# EAGLE design dual-tda1543-dac (EAGLE 6.5.0)
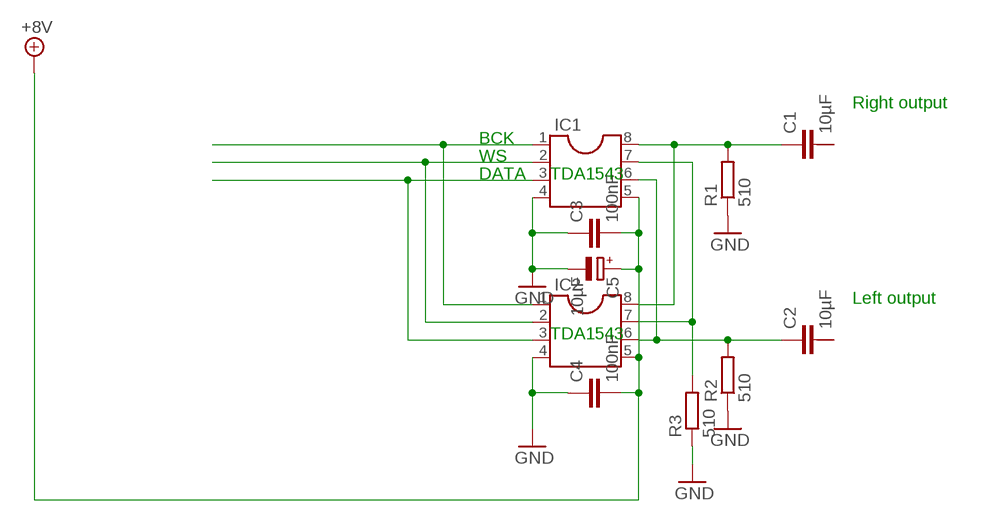
[diagram p0: schematic, sheet 1]

## Parts
C1  10µF  C-10-15/6  [C10-15B6]
C2  10µF  C-10-15/6  [C10-15B6]
C3  100nF  C-EU025-024X044  [C025-024X044]
C4  100nF  C-EU025-024X044  [C025-024X044]
C5  10µF  CPOL-EUE3.5-8  [E3,5-8]
IC1  TDA1543S  [SOCKED-08]
IC2  TDA1543S  [SOCKED-08]
R1  510  R-EU_0207/7  [0207/7]
R2  510  R-EU_0207/7  [0207/7]
R3  510  R-EU_0207/7  [0207/7]

## Nets
+5V: C3.2 C4.2 C5.+ IC1.5(AOR) IC2.5(AOR) ; supply symbol labelled +8V
GND: C3.1 C4.1 C5.- IC1.4(GND) IC2.4(GND) R1.1 R2.1 R3.1
N$1: IC1.1(BCK) IC2.1(BCK)
N$2: IC1.2(WS) IC2.2(WS)
N$3: IC1.3(DATA) IC2.3(DATA)
N$4: C2.1 IC1.6(VREF) IC2.6(VREF) R2.2
N$5: C1.1 IC1.8(VDD) IC2.8(VDD) R1.2
N$6: IC1.7(AOL) IC2.7(AOL) R3.2
Unconnected: C1.2 C1.3 C2.2 C2.3

## Notes on the sheet
- Right output
- BCK
- WS
- DATA | TDA1543
- Left output
- TDA1543

## Library data of the parts
C1 C2 = capacitor-wima:C-: CAPACITOR for alternative placement naming: default grid - extended grid/package width
C3 C4 = resistor:C-EU: CAPACITOR, European symbol
C5 = resistor:CPOL-EU: POLARIZED CAPACITOR, European symbol
IC1 IC2 = tda1543:TDA1543: Dual 16-bit DAC (economy version) (I2S input format)
R1-R3 = resistor:R-EU_: RESISTOR, European symbol

## Board
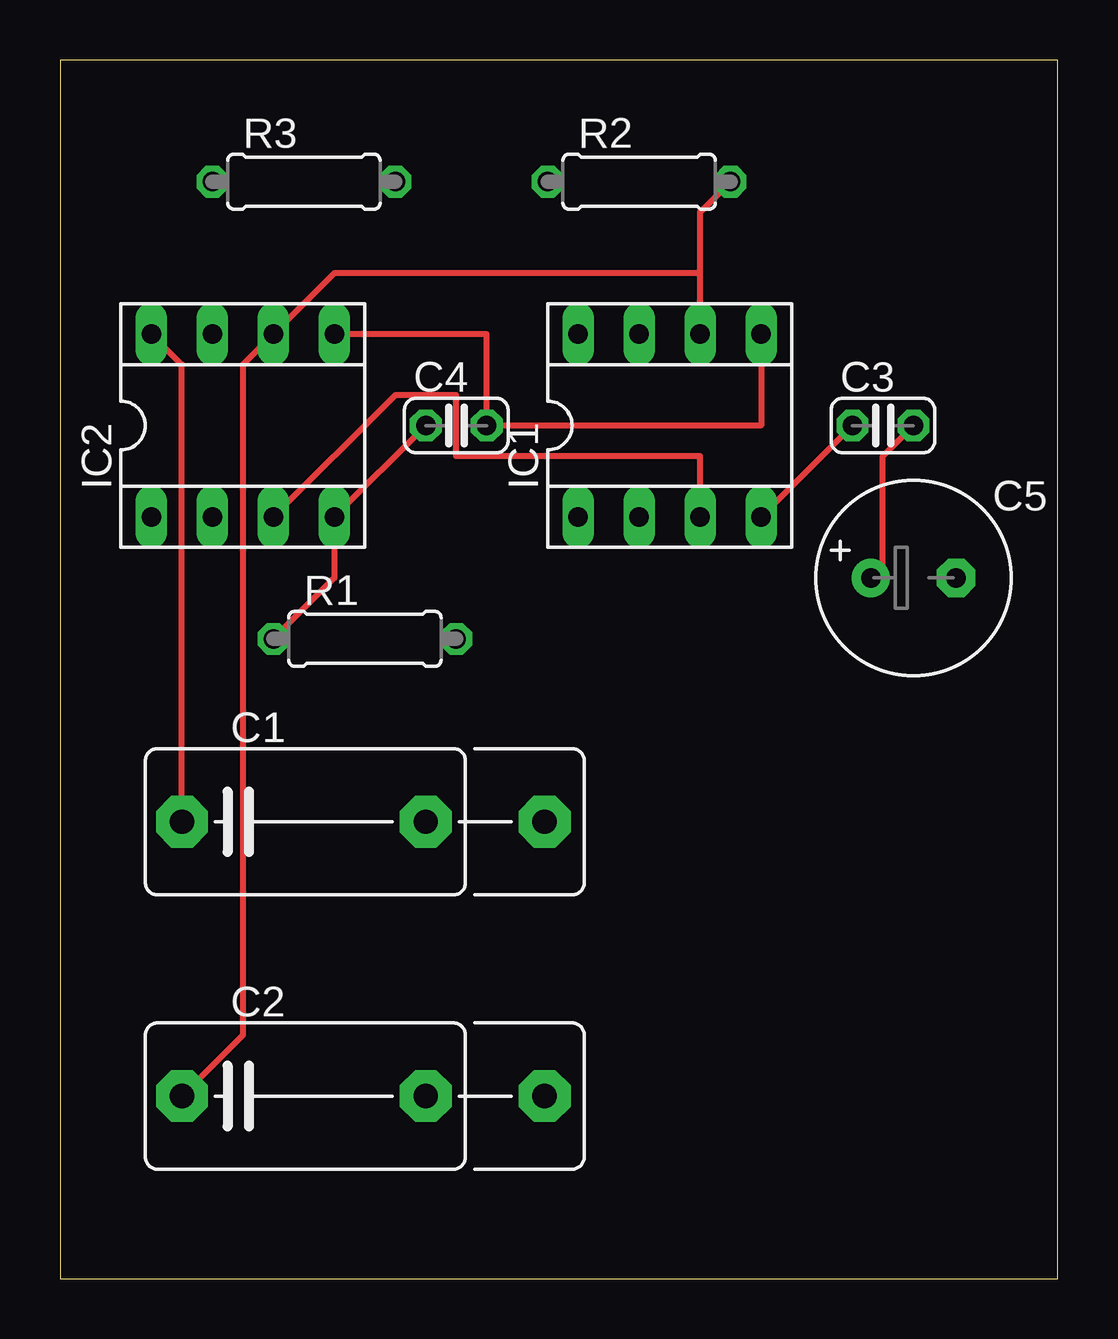
[diagram p1: board, top side]
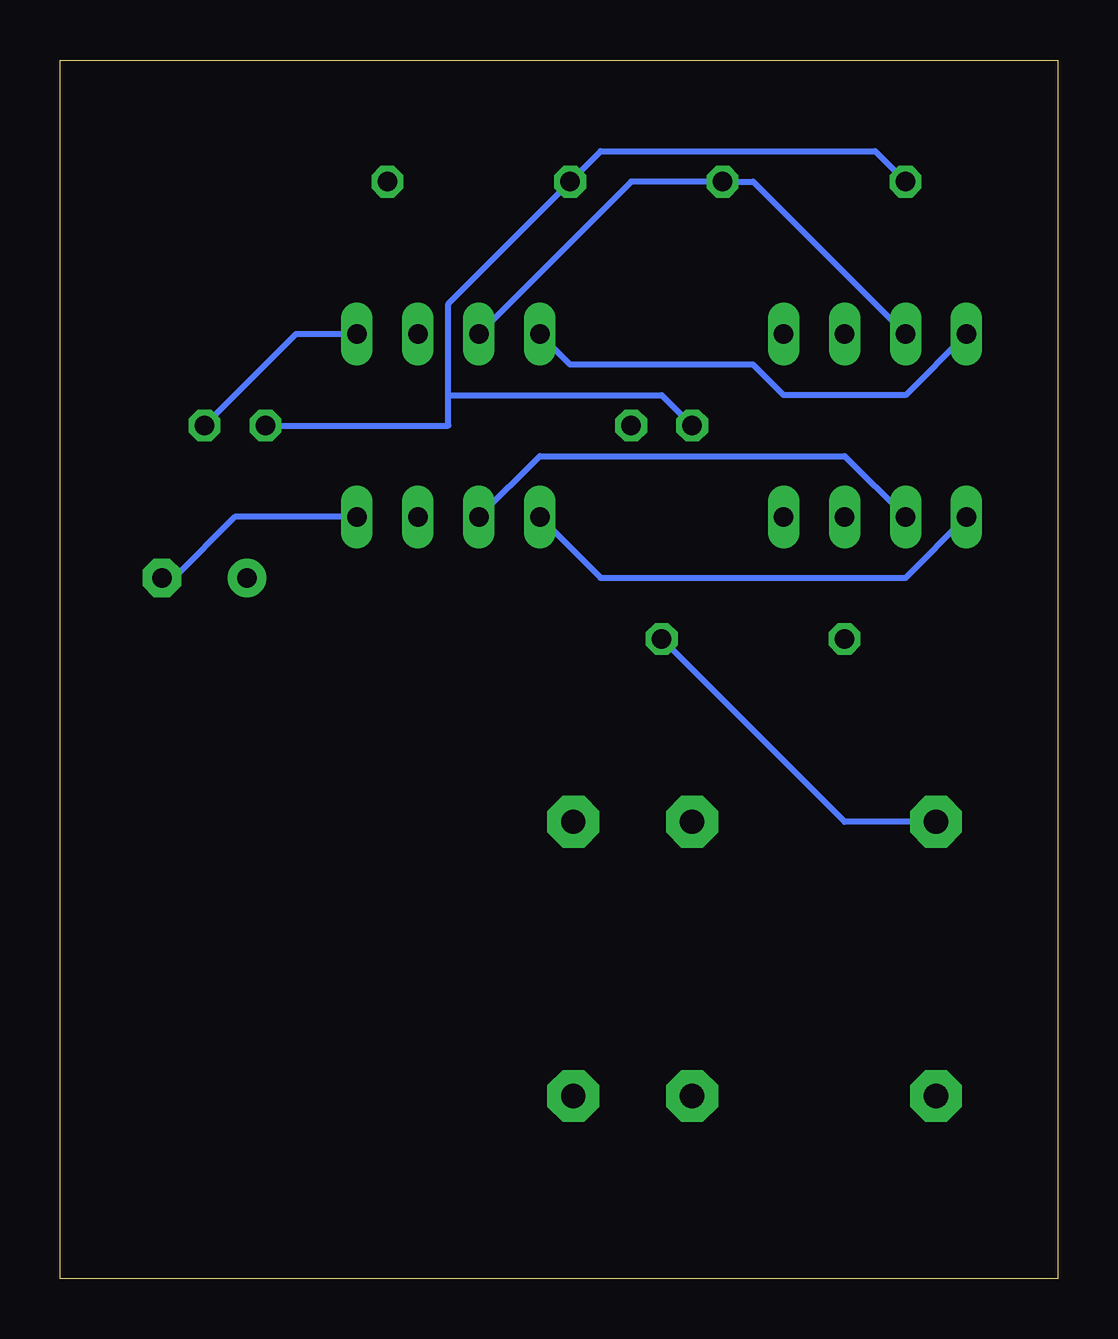
[diagram p2: board, bottom side, seen from below]

Size 41.58 x 50.79 mm. Coordinates in mm from the lower left corner, seen from the top.
Outline: 0,0 41.58,0 41.58,50.79 0,50.79 0,0
Copper layers (1*16): Top 0.035mm / dielectric 1.5mm / Bottom 0.035mm
Design rules "default": minimum track width 10mil, minimum drill 24mil, track to track 8mil, track to pad 8mil, pad to pad 8mil, via to via 8mil, smd to smd 8mil, copper to edge 40mil, drill to drill 8mil, minimum pad ring 10mil, minimum via ring 8mil, stop-mask expansion 4mil, vias tented up to drill 0mil, thermal gap 10mil

### Footprints (pad centres in the part's own frame; a part is rotated, then mirrored left to right if it is on the bottom)
C10-15B6 = drill 1.016 pad 2.159 octagon: 1 -5.08,0; 2 5.08,0; 3 10.033,0
C025-024X044 = drill 0.813 octagon: 1 -1.27,0; 2 1.27,0
E3,5-8 = drill 0.813 pad 1.6: + -1.778,0 | drill 0.813 pad 1.6 octagon: - 1.778,0
SOCKED-08 = drill 0.813 long: 1 -3.81,-3.81; 2 -1.27,-3.81; 3 1.27,-3.81; 4 3.81,-3.81; 5 3.81,3.81; 6 1.27,3.81; 7 -1.27,3.81; 8 -3.81,3.81
0207/7 = drill 0.813 octagon: 1 -3.81,0; 2 3.81,0

### Placement (x,y rotation side)
C1  10.16,19.05 0 top
C2  10.16,7.62 0 top
C3  34.29,35.56 0 top
C4  16.51,35.56 0 top
C5  35.56,29.21 0 top
IC1  25.4,35.56 0 top
IC2  7.62,35.56 0 top
R1  12.7,26.67 0 top
R2  24.13,45.72 0 top
R3  10.16,45.72 0 top

### Tracks (layer width: path | path; a pad name or v marks a point on that pad's centre or on a via)
+5V
  Top 0.254: C3.2 34.29,34.29 34.29,29.21 C5.+ | IC1.5 29.21,35.56 C4.2 17.78,39.37 IC2.5
  Bottom 0.254: C3.2 31.75,39.37 IC1.5
GND
  Top 0.254: R1.1 11.43,29.21 IC2.4 C4.1 | C3.1 IC1.4
  Bottom 0.254: R3.1 7.62,46.99 19.05,46.99 R2.1 25.4,40.64 25.4,36.83 | IC1.4 34.29,31.75 36.83,29.21 C5.- | 25.4,36.83 25.4,35.56 C3.1 | C4.1 16.51,36.83 25.4,36.83
N$1
  Bottom 0.254: IC2.1 6.35,29.21 19.05,29.21 IC1.1
N$2
  Bottom 0.254: IC2.2 8.89,34.29 21.59,34.29 IC1.2
N$3
  Top 0.254: IC2.3 13.97,36.83 16.51,36.83 16.51,34.29 26.67,34.29 IC1.3
N$4
  Top 0.254: 26.67,41.91 11.43,41.91 IC2.6 7.62,38.1 7.62,10.16 C2.1 | IC1.6 26.67,41.91 | R2.2 26.67,44.45 26.67,41.91
N$5
  Top 0.254: IC2.8 5.08,38.1 C1.1
  Bottom 0.254: R1.2 8.89,19.05 C1.1 | IC1.8 20.32,38.1 12.7,38.1 11.43,36.83 6.35,36.83 IC2.8
N$6
  Bottom 0.254: IC2.7 12.7,45.72 R3.2 17.78,45.72 IC1.7